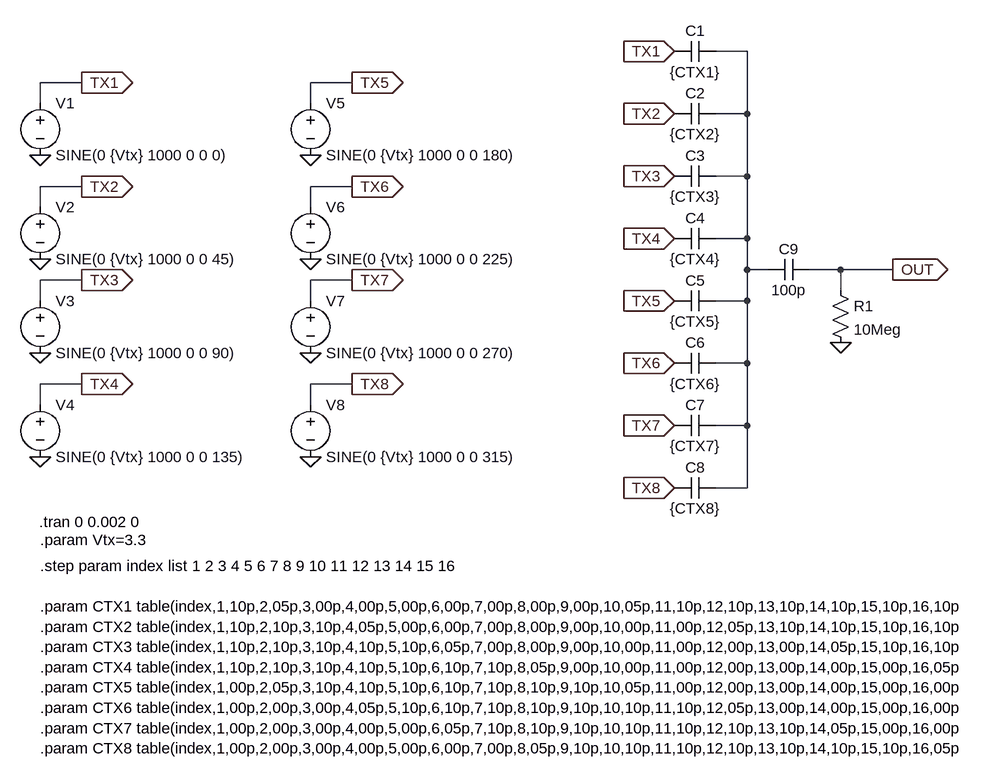
[diagram p0: schematic dispSensSim.asc]
dispSensSim.asc, the LTspice schematic file:
Version 4
SHEET 1 2064 1108
WIRE 1152 48 1104 48
WIRE 128 96 64 96
WIRE 544 96 480 96
WIRE 64 128 64 96
WIRE 480 128 480 96
WIRE 1152 144 1152 48
WIRE 1152 144 1104 144
WIRE 1152 240 1152 144
WIRE 1152 240 1104 240
WIRE 128 256 64 256
WIRE 544 256 480 256
WIRE 64 288 64 256
WIRE 480 288 480 256
WIRE 1152 336 1152 240
WIRE 1152 336 1104 336
WIRE 1152 384 1152 336
WIRE 1184 384 1152 384
WIRE 1296 384 1248 384
WIRE 1376 384 1296 384
WIRE 128 400 64 400
WIRE 544 400 480 400
WIRE 1296 416 1296 384
WIRE 64 432 64 400
WIRE 480 432 480 400
WIRE 1152 432 1152 384
WIRE 1152 432 1104 432
WIRE 1152 528 1152 432
WIRE 1152 528 1104 528
WIRE 128 560 64 560
WIRE 544 560 480 560
WIRE 64 592 64 560
WIRE 480 592 480 560
WIRE 1152 624 1152 528
WIRE 1152 624 1104 624
WIRE 1152 720 1152 624
WIRE 1152 720 1104 720
FLAG 64 208 0
FLAG 128 96 TX1
IOPIN 128 96 Out
FLAG 64 368 0
FLAG 128 256 TX2
IOPIN 128 256 Out
FLAG 64 512 0
FLAG 128 400 TX3
IOPIN 128 400 Out
FLAG 64 672 0
FLAG 128 560 TX4
IOPIN 128 560 Out
FLAG 480 208 0
FLAG 544 96 TX5
IOPIN 544 96 Out
FLAG 480 368 0
FLAG 544 256 TX6
IOPIN 544 256 Out
FLAG 480 512 0
FLAG 544 400 TX7
IOPIN 544 400 Out
FLAG 480 672 0
FLAG 544 560 TX8
IOPIN 544 560 Out
FLAG 1040 48 TX1
IOPIN 1040 48 In
FLAG 1040 144 TX2
IOPIN 1040 144 In
FLAG 1040 240 TX3
IOPIN 1040 240 In
FLAG 1040 336 TX4
IOPIN 1040 336 In
FLAG 1040 432 TX5
IOPIN 1040 432 In
FLAG 1040 528 TX6
IOPIN 1040 528 In
FLAG 1040 624 TX7
IOPIN 1040 624 In
FLAG 1040 720 TX8
IOPIN 1040 720 In
FLAG 1296 496 0
FLAG 1376 384 OUT
IOPIN 1376 384 Out
SYMBOL voltage 64 112 R0
WINDOW 123 0 0 Left 0
WINDOW 39 0 0 Left 0
SYMATTR InstName V1
SYMATTR Value SINE(0 {Vtx} 1000 0 0 0)
SYMBOL voltage 64 272 R0
WINDOW 123 0 0 Left 0
WINDOW 39 0 0 Left 0
SYMATTR InstName V2
SYMATTR Value SINE(0 {Vtx} 1000 0 0 45)
SYMBOL voltage 64 416 R0
WINDOW 123 0 0 Left 0
WINDOW 39 0 0 Left 0
SYMATTR InstName V3
SYMATTR Value SINE(0 {Vtx} 1000 0 0 90)
SYMBOL voltage 64 576 R0
WINDOW 123 0 0 Left 0
WINDOW 39 0 0 Left 0
SYMATTR InstName V4
SYMATTR Value SINE(0 {Vtx} 1000 0 0 135)
SYMBOL voltage 480 112 R0
WINDOW 123 0 0 Left 0
WINDOW 39 0 0 Left 0
SYMATTR InstName V5
SYMATTR Value SINE(0 {Vtx} 1000 0 0 180)
SYMBOL voltage 480 272 R0
WINDOW 123 0 0 Left 0
WINDOW 39 0 0 Left 0
SYMATTR InstName V6
SYMATTR Value SINE(0 {Vtx} 1000 0 0 225)
SYMBOL voltage 480 416 R0
WINDOW 123 0 0 Left 0
WINDOW 39 0 0 Left 0
SYMATTR InstName V7
SYMATTR Value SINE(0 {Vtx} 1000 0 0 270)
SYMBOL voltage 480 576 R0
WINDOW 123 0 0 Left 0
WINDOW 39 0 0 Left 0
SYMATTR InstName V8
SYMATTR Value SINE(0 {Vtx} 1000 0 0 315)
SYMBOL cap 1040 64 R270
WINDOW 0 32 32 VTop 2
WINDOW 3 0 32 VBottom 2
SYMATTR InstName C1
SYMATTR Value {CTX1}
SYMBOL cap 1040 160 R270
WINDOW 0 32 32 VTop 2
WINDOW 3 0 32 VBottom 2
SYMATTR InstName C2
SYMATTR Value {CTX2}
SYMBOL cap 1040 256 R270
WINDOW 0 32 32 VTop 2
WINDOW 3 0 32 VBottom 2
SYMATTR InstName C3
SYMATTR Value {CTX3}
SYMBOL cap 1040 352 R270
WINDOW 0 32 32 VTop 2
WINDOW 3 0 32 VBottom 2
SYMATTR InstName C4
SYMATTR Value {CTX4}
SYMBOL cap 1040 448 R270
WINDOW 0 32 32 VTop 2
WINDOW 3 0 32 VBottom 2
SYMATTR InstName C5
SYMATTR Value {CTX5}
SYMBOL cap 1104 512 R90
WINDOW 0 0 32 VBottom 2
WINDOW 3 32 32 VTop 2
SYMATTR InstName C6
SYMATTR Value {CTX6}
SYMBOL cap 1104 608 R90
WINDOW 0 0 32 VBottom 2
WINDOW 3 32 32 VTop 2
SYMATTR InstName C7
SYMATTR Value {CTX7}
SYMBOL cap 1104 704 R90
WINDOW 0 0 32 VBottom 2
WINDOW 3 32 32 VTop 2
SYMATTR InstName C8
SYMATTR Value {CTX8}
SYMBOL cap 1248 368 R90
WINDOW 0 0 32 VBottom 2
WINDOW 3 32 32 VTop 2
SYMATTR InstName C9
SYMATTR Value 100p
SYMBOL res 1280 400 R0
SYMATTR InstName R1
SYMATTR Value 10Meg
TEXT 62 772 Left 2 !.tran 0 0.002 0
TEXT 64 800 Left 2 !.param Vtx=3.3
TEXT 64 840 Left 2 !.step param index list 1 2 3 4 5 6 7 8 9 10 11 12 13 14 15 16\n \n.param CTX1 table(index,1,10p,2,05p,3,00p,4,00p,5,00p,6,00p,7,00p,8,00p,9,00p,10,05p,11,10p,12,10p,13,10p,14,10p,15,10p,16,10p\n.param CTX2 table(index,1,10p,2,10p,3,10p,4,05p,5,00p,6,00p,7,00p,8,00p,9,00p,10,00p,11,00p,12,05p,13,10p,14,10p,15,10p,16,10p\n.param CTX3 table(index,1,10p,2,10p,3,10p,4,10p,5,10p,6,05p,7,00p,8,00p,9,00p,10,00p,11,00p,12,00p,13,00p,14,05p,15,10p,16,10p\n.param CTX4 table(index,1,10p,2,10p,3,10p,4,10p,5,10p,6,10p,7,10p,8,05p,9,00p,10,00p,11,00p,12,00p,13,00p,14,00p,15,00p,16,05p\n.param CTX5 table(index,1,00p,2,05p,3,10p,4,10p,5,10p,6,10p,7,10p,8,10p,9,10p,10,05p,11,00p,12,00p,13,00p,14,00p,15,00p,16,00p\n.param CTX6 table(index,1,00p,2,00p,3,00p,4,05p,5,10p,6,10p,7,10p,8,10p,9,10p,10,10p,11,10p,12,05p,13,00p,14,00p,15,00p,16,00p\n.param CTX7 table(index,1,00p,2,00p,3,00p,4,00p,5,00p,6,05p,7,10p,8,10p,9,10p,10,10p,11,10p,12,10p,13,10p,14,05p,15,00p,16,00p\n.param CTX8 table(index,1,00p,2,00p,3,00p,4,00p,5,00p,6,00p,7,00p,8,05p,9,10p,10,10p,11,10p,12,10p,13,10p,14,10p,15,10p,16,05p

The netlist it stands for:
* dispSensSim.asc
V1 TX1 0 SINE(0 {Vtx} 1000 0 0 0)
V2 TX2 0 SINE(0 {Vtx} 1000 0 0 45)
V3 TX3 0 SINE(0 {Vtx} 1000 0 0 90)
V4 TX4 0 SINE(0 {Vtx} 1000 0 0 135)
V5 TX5 0 SINE(0 {Vtx} 1000 0 0 180)
V6 TX6 0 SINE(0 {Vtx} 1000 0 0 225)
V7 TX7 0 SINE(0 {Vtx} 1000 0 0 270)
V8 TX8 0 SINE(0 {Vtx} 1000 0 0 315)
C1 TX1 N001 {CTX1}
C2 TX2 N001 {CTX2}
C3 TX3 N001 {CTX3}
C4 TX4 N001 {CTX4}
C5 TX5 N001 {CTX5}
C6 N001 TX6 {CTX6}
C7 N001 TX7 {CTX7}
C8 N001 TX8 {CTX8}
C9 OUT N001 100p
R1 OUT 0 10Meg
.tran 0 0.002 0
.param Vtx=3.3
.step param index list 1 2 3 4 5 6 7 8 9 10 11 12 13 14 15 16
.param CTX1 table(index,1,10p,2,05p,3,00p,4,00p,5,00p,6,00p,7,00p,8,00p,9,00p,10,05p,11,10p,12,10p,13,10p,14,10p,15,10p,16,10p
.param CTX2 table(index,1,10p,2,10p,3,10p,4,05p,5,00p,6,00p,7,00p,8,00p,9,00p,10,00p,11,00p,12,05p,13,10p,14,10p,15,10p,16,10p
.param CTX3 table(index,1,10p,2,10p,3,10p,4,10p,5,10p,6,05p,7,00p,8,00p,9,00p,10,00p,11,00p,12,00p,13,00p,14,05p,15,10p,16,10p
.param CTX4 table(index,1,10p,2,10p,3,10p,4,10p,5,10p,6,10p,7,10p,8,05p,9,00p,10,00p,11,00p,12,00p,13,00p,14,00p,15,00p,16,05p
.param CTX5 table(index,1,00p,2,05p,3,10p,4,10p,5,10p,6,10p,7,10p,8,10p,9,10p,10,05p,11,00p,12,00p,13,00p,14,00p,15,00p,16,00p
.param CTX6 table(index,1,00p,2,00p,3,00p,4,05p,5,10p,6,10p,7,10p,8,10p,9,10p,10,10p,11,10p,12,05p,13,00p,14,00p,15,00p,16,00p
.param CTX7 table(index,1,00p,2,00p,3,00p,4,00p,5,00p,6,05p,7,10p,8,10p,9,10p,10,10p,11,10p,12,10p,13,10p,14,05p,15,00p,16,00p
.param CTX8 table(index,1,00p,2,00p,3,00p,4,00p,5,00p,6,00p,7,00p,8,05p,9,10p,10,10p,11,10p,12,10p,13,10p,14,10p,15,10p,16,05p
.backanno
.end